# Altium schematic sheet DAC.SchDoc
size A4
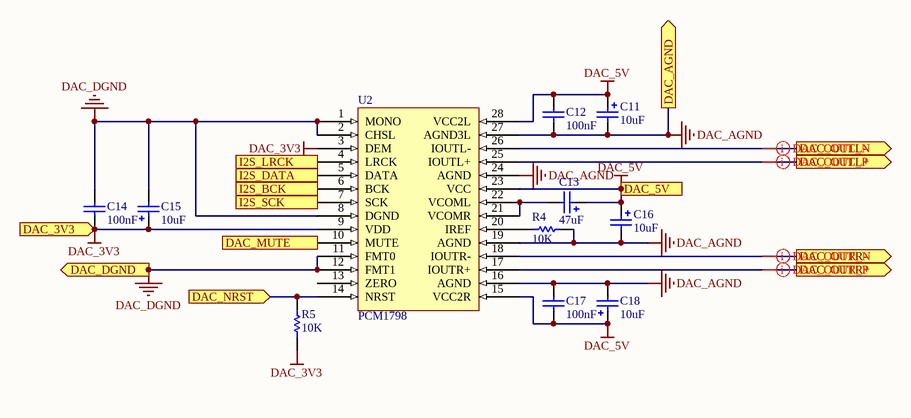
[diagram p0: DAC.SchDoc]

## Parts
C11  10uF  [THT_Cap5x11]
C12  100nF  [SMC_0402]
C13  47uF  [THT_Cap5x11]
C14  100nF  [SMC_0402]
C15  10uF  [THT_Cap5x11]
C16  10uF  [THT_Cap5x11]
C17  100nF  [SMC_0402]
C18  10uF  [THT_Cap5x11]
R4  10K  [SMR_0402]
R5  10K  [SMR_0402]
U2  PCM1798  [SOP65P780X200-28N]

## Ports
DAC_3V3 (in), DAC_5V (in), DAC_AGND (out), DAC_DGND (out), DAC_MUTE (in), DAC_NRST (in), DAC_OUTL+ (out), DAC_OUTL- (out), DAC_OUTR+ (out), DAC_OUTR- (out), I2S_BCK (in), I2S_DATA (in), I2S_LRCK (in), I2S_SCK (in)

## Nets
DAC_3V3: C14.1 C15.A R5.1 U2.3(DEM) U2.9(VDD) ; port DAC_3V3
DAC_5V: C11.A C12.2 C13.A C16.A C17.2 C18.A U2.15(VCC2R) U2.23(VCC) U2.28(VCC2L) ; port DAC_5V
DAC_AGND: C11.K C12.1 C16.K C17.1 C18.K R4.2 U2.16(AGND) U2.19(AGND) U2.24(AGND) U2.27(AGND3L) ; port DAC_AGND
DAC_DGND: C14.2 C15.K U2.1(MONO) U2.2(CHSL) U2.8(DGND) U2.11(FMT0) U2.12(FMT1) ; port DAC_DGND
DAC_MUTE: U2.10(MUTE) ; port DAC_MUTE
DAC_NRST: R5.2 U2.14(NRST) ; port DAC_NRST
DAC_OUTL+: U2.25(IOUTL+) ; port DAC_OUTL+
DAC_OUTL-: U2.26(IOUTL-) ; port DAC_OUTL-
DAC_OUTR+: U2.17(IOUTR+) ; port DAC_OUTR+
DAC_OUTR-: U2.18(IOUTR-) ; port DAC_OUTR-
I2S_BCK: U2.6(BCK) ; port I2S_BCK
I2S_DATA: U2.5(DATA) ; port I2S_DATA
I2S_LRCK: U2.4(LRCK) ; port I2S_LRCK
I2S_SCK: U2.7(SCK) ; port I2S_SCK
NetC13_K: C13.K U2.21(VCOMR) U2.22(VCOML)
NetR4_1: R4.1 U2.20(IREF)

Not connected (* = marked no-connect by the designer): U2 13(ZERO)

## Layout directives
differential pair: DAC_OUTL+, DAC_OUTL-, DAC_OUTR+, DAC_OUTR-

## Library data of the parts
C11 C13 C15 C16 C18 = Cap Electrolyte
C12 C14 C17 = Cap Ceramic
R4 R5 = Res SMT